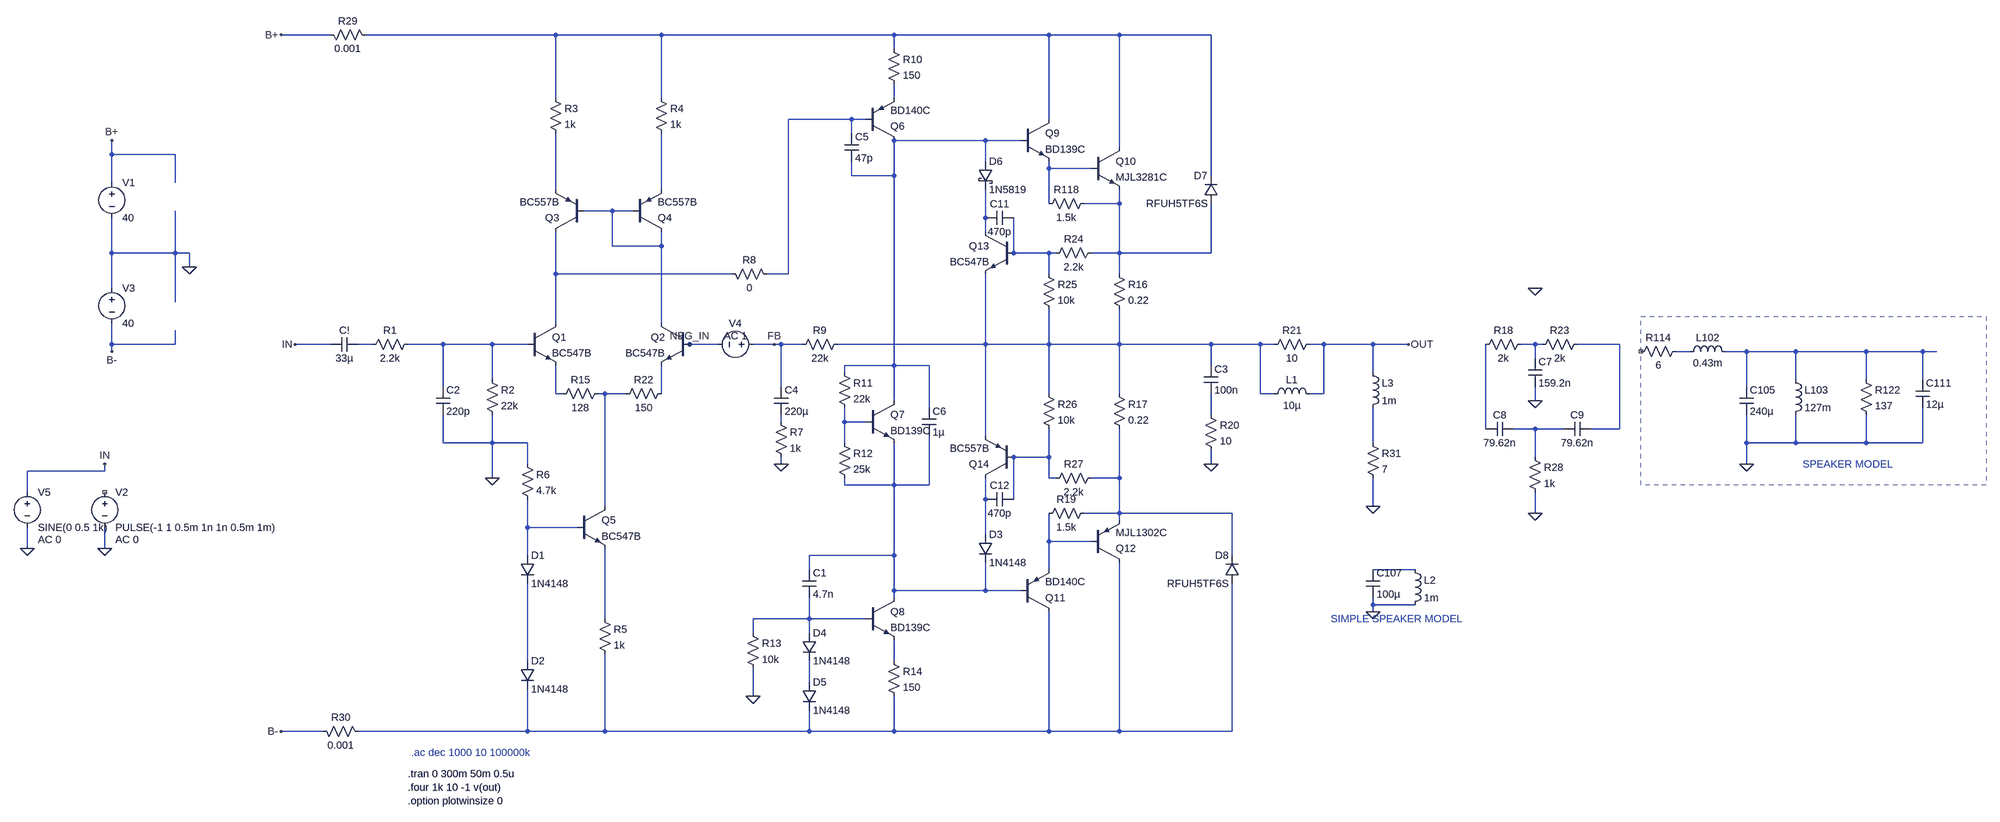
[diagram p0: schematic class_ab.asc]
class_ab.asc, the LTspice schematic file:
Version 4
SHEET 1 3476 872
WIRE -528 -880 -640 -880
WIRE -16 -880 -448 -880
WIRE 224 -880 -16 -880
WIRE 752 -880 224 -880
WIRE 1104 -880 752 -880
WIRE 1264 -880 1104 -880
WIRE 1472 -880 1264 -880
WIRE 752 -848 752 -880
WIRE -16 -736 -16 -880
WIRE 224 -736 224 -880
WIRE 752 -736 752 -768
WIRE 656 -688 512 -688
WIRE 688 -688 656 -688
WIRE 1104 -688 1104 -880
WIRE 656 -656 656 -688
WIRE 960 -640 752 -640
WIRE 1040 -640 960 -640
WIRE 1264 -624 1264 -880
WIRE -1024 -608 -1024 -640
WIRE -880 -608 -1024 -608
WIRE 960 -592 960 -640
WIRE 1104 -576 1104 -592
WIRE 1200 -576 1104 -576
WIRE 656 -560 656 -592
WIRE 752 -560 752 -640
WIRE 752 -560 656 -560
WIRE 1472 -560 1472 -880
WIRE -1024 -544 -1024 -608
WIRE -880 -544 -880 -608
WIRE -16 -528 -16 -656
WIRE 224 -528 224 -656
WIRE 1104 -496 1104 -576
WIRE 1264 -496 1264 -528
WIRE 1264 -496 1184 -496
WIRE 112 -480 48 -480
WIRE 160 -480 112 -480
WIRE 960 -464 960 -528
WIRE 960 -432 960 -464
WIRE 112 -400 112 -480
WIRE 224 -400 224 -432
WIRE 224 -400 112 -400
WIRE -1024 -384 -1024 -464
WIRE -880 -384 -880 -480
WIRE -880 -384 -1024 -384
WIRE -848 -384 -880 -384
WIRE 1024 -384 1024 -464
WIRE 1104 -384 1024 -384
WIRE 1120 -384 1104 -384
WIRE 1264 -384 1264 -496
WIRE 1264 -384 1200 -384
WIRE 1472 -384 1472 -496
WIRE 1472 -384 1264 -384
WIRE -848 -352 -848 -384
WIRE -16 -336 -16 -432
WIRE 384 -336 -16 -336
WIRE 512 -336 512 -688
WIRE 512 -336 464 -336
WIRE 1104 -336 1104 -384
WIRE 1264 -336 1264 -384
WIRE -1024 -304 -1024 -384
WIRE -880 -272 -880 -384
WIRE -16 -224 -16 -336
WIRE 224 -224 224 -400
WIRE -1024 -176 -1024 -224
WIRE -880 -176 -880 -208
WIRE -880 -176 -1024 -176
WIRE -528 -176 -608 -176
WIRE -432 -176 -464 -176
WIRE -272 -176 -352 -176
WIRE -160 -176 -272 -176
WIRE -80 -176 -160 -176
WIRE 288 -176 272 -176
WIRE 352 -176 288 -176
WIRE 480 -176 432 -176
WIRE 496 -176 480 -176
WIRE 544 -176 496 -176
WIRE 960 -176 960 -336
WIRE 960 -176 624 -176
WIRE 1104 -176 1104 -256
WIRE 1104 -176 960 -176
WIRE 1264 -176 1264 -256
WIRE 1264 -176 1104 -176
WIRE 1472 -176 1264 -176
WIRE 1584 -176 1472 -176
WIRE 1616 -176 1584 -176
WIRE 1728 -176 1696 -176
WIRE 1840 -176 1728 -176
WIRE 1920 -176 1840 -176
WIRE 2208 -176 2176 -176
WIRE 2224 -176 2208 -176
WIRE 2400 -176 2304 -176
WIRE -1024 -160 -1024 -176
WIRE 2560 -160 2528 -160
WIRE 2688 -160 2640 -160
WIRE 2800 -160 2688 -160
WIRE 2960 -160 2800 -160
WIRE 3088 -160 2960 -160
WIRE 3120 -160 3088 -160
WIRE 2208 -144 2208 -176
WIRE 752 -128 752 -560
WIRE 752 -128 640 -128
WIRE 832 -128 752 -128
WIRE 1472 -128 1472 -176
WIRE 640 -112 640 -128
WIRE 1840 -112 1840 -176
WIRE -160 -96 -160 -176
WIRE 2800 -96 2800 -160
WIRE 2960 -96 2960 -160
WIRE 3088 -96 3088 -160
WIRE -272 -80 -272 -176
WIRE 496 -80 496 -176
WIRE 2688 -80 2688 -160
WIRE -16 -64 -16 -128
WIRE 0 -64 -16 -64
WIRE 96 -64 80 -64
WIRE 144 -64 96 -64
WIRE 224 -64 224 -128
WIRE 1104 -64 1104 -176
WIRE 1264 -64 1264 -176
WIRE 1584 -64 1584 -176
WIRE 1616 -64 1584 -64
WIRE 1728 -64 1728 -176
WIRE 1728 -64 1696 -64
WIRE 752 -48 752 -128
WIRE 2208 -48 2208 -80
WIRE 832 -32 832 -128
WIRE 1472 -16 1472 -64
WIRE 496 0 496 -16
WIRE 640 0 640 -32
WIRE 688 0 640 0
WIRE 2096 16 2096 -176
WIRE 2208 16 2160 16
WIRE 2272 16 2208 16
WIRE 2400 16 2400 -176
WIRE 2400 16 2336 16
WIRE 960 32 960 -176
WIRE -272 48 -272 -16
WIRE -160 48 -160 -16
WIRE -160 48 -272 48
WIRE -80 48 -160 48
WIRE 640 48 640 0
WIRE 1840 48 1840 -32
WIRE 2688 48 2688 -16
WIRE 2800 48 2800 -16
WIRE 2800 48 2688 48
WIRE 2960 48 2960 -16
WIRE 2960 48 2800 48
WIRE 3088 48 3088 -32
WIRE 3088 48 2960 48
WIRE 1104 80 1104 16
WIRE 1104 80 1024 80
WIRE 2208 80 2208 16
WIRE -80 96 -80 48
WIRE 496 96 496 80
WIRE 1472 96 1472 64
WIRE 2688 96 2688 48
WIRE -1040 112 -1040 96
WIRE -1040 112 -1216 112
WIRE -160 128 -160 48
WIRE 1104 128 1104 80
WIRE 1120 128 1104 128
WIRE 1264 128 1264 16
WIRE 1264 128 1200 128
WIRE 640 144 640 128
WIRE 752 144 752 48
WIRE 752 144 640 144
WIRE 832 144 832 32
WIRE 832 144 752 144
WIRE -1216 160 -1216 112
WIRE 960 176 960 128
WIRE 1024 176 1024 80
WIRE 96 192 96 -64
WIRE 1840 192 1840 128
WIRE 1264 208 1264 128
WIRE 1264 208 1184 208
WIRE 1520 208 1264 208
WIRE 2208 208 2208 160
WIRE 1264 224 1264 208
WIRE -80 240 -80 176
WIRE 32 240 -80 240
WIRE 960 256 960 176
WIRE 1104 272 1104 208
WIRE 1200 272 1104 272
WIRE -1216 288 -1216 240
WIRE -1040 288 -1040 240
WIRE -80 304 -80 240
WIRE 752 304 752 144
WIRE 752 304 560 304
WIRE 1520 304 1520 208
WIRE 560 336 560 304
WIRE 1104 336 1104 272
WIRE 1936 336 1840 336
WIRE 752 384 752 304
WIRE 960 384 960 320
WIRE 960 384 752 384
WIRE 1040 384 960 384
WIRE 752 400 752 384
WIRE 1840 416 1840 400
WIRE 1936 416 1840 416
WIRE 1840 432 1840 416
WIRE 96 448 96 288
WIRE 560 448 560 400
WIRE 560 448 432 448
WIRE 688 448 560 448
WIRE 432 480 432 448
WIRE 560 480 560 448
WIRE -80 544 -80 368
WIRE 752 544 752 496
WIRE 560 592 560 544
WIRE 432 624 432 560
WIRE -544 704 -640 704
WIRE -80 704 -80 608
WIRE -80 704 -464 704
WIRE 96 704 96 528
WIRE 96 704 -80 704
WIRE 560 704 560 656
WIRE 560 704 96 704
WIRE 752 704 752 624
WIRE 752 704 560 704
WIRE 1104 704 1104 432
WIRE 1104 704 752 704
WIRE 1264 704 1264 320
WIRE 1264 704 1104 704
WIRE 1520 704 1520 368
WIRE 1520 704 1264 704
FLAG 496 96 0
FLAG -608 -176 IN
FLAG -1040 96 IN
FLAG -1040 288 0
FLAG -640 704 B-
FLAG -640 -880 B+
FLAG -848 -352 0
FLAG -1024 -640 B+
FLAG -1024 -160 B-
FLAG 1920 -176 OUT
FLAG -160 128 0
FLAG 2688 96 0
FLAG 432 624 0
FLAG 288 -176 NEG_IN
FLAG 480 -176 FB
FLAG 1472 96 0
FLAG 1840 432 0
FLAG -1216 288 0
FLAG 2208 -48 0
FLAG 2208 -304 0
FLAG 2208 208 0
FLAG 1840 192 0
SYMBOL npn 32 192 R0
SYMATTR InstName Q5
SYMATTR Value BC547B
SYMBOL res 80 432 R0
SYMATTR InstName R5
SYMATTR Value 1k
SYMBOL res -96 80 R0
SYMATTR InstName R6
SYMATTR Value 4.7k
SYMBOL npn -80 -224 R0
SYMATTR InstName Q1
SYMATTR Value BC547B
SYMBOL npn 288 -224 M0
SYMATTR InstName Q2
SYMATTR Value BC547B
SYMBOL voltage -1040 144 R0
WINDOW 123 24 124 Left 2
WINDOW 39 0 0 Left 0
SYMATTR Value2 AC 0
SYMATTR InstName V2
SYMATTR Value PULSE(-1 1 0.5m 1n 1n 0.5m 1m)
SYMBOL cap -464 -192 R90
WINDOW 0 0 32 VBottom 2
WINDOW 3 32 32 VTop 2
SYMATTR InstName C!
SYMATTR Value 33µ
SYMBOL voltage -1024 -320 R0
WINDOW 123 0 0 Left 0
WINDOW 39 24 44 Left 2
SYMATTR InstName V3
SYMATTR Value 40
SYMBOL res 640 -192 R90
WINDOW 0 0 56 VBottom 2
WINDOW 3 32 56 VTop 2
SYMATTR InstName R9
SYMATTR Value 22k
SYMBOL res 480 -16 R0
SYMATTR InstName R7
SYMATTR Value 1k
SYMBOL pnp 688 -640 M180
SYMATTR InstName Q6
SYMATTR Value BD140C
SYMBOL npn 1200 -624 R0
SYMATTR InstName Q10
SYMATTR Value MJL3281C
SYMBOL pnp 1200 320 M180
SYMATTR InstName Q12
SYMATTR Value MJL1302C
SYMBOL res 1248 -352 R0
SYMATTR InstName R16
SYMATTR Value 0.22
SYMBOL res 1248 -80 R0
SYMATTR InstName R17
SYMATTR Value 0.22
SYMBOL cap 480 -80 R0
SYMATTR InstName C4
SYMATTR Value 220µ
SYMBOL res 736 -864 R0
SYMATTR InstName R10
SYMATTR Value 150
SYMBOL npn 1040 -688 R0
SYMATTR InstName Q9
SYMATTR Value BD139C
SYMBOL pnp 1040 432 M180
SYMATTR InstName Q11
SYMATTR Value BD140C
SYMBOL res -176 -112 R0
SYMATTR InstName R2
SYMATTR Value 22k
SYMBOL cap -288 -80 R0
SYMATTR InstName C2
SYMATTR Value 220p
SYMBOL res -336 -192 R90
WINDOW 0 0 56 VBottom 2
WINDOW 3 32 56 VTop 2
SYMATTR InstName R1
SYMATTR Value 2.2k
SYMBOL diode -96 304 R0
SYMATTR InstName D1
SYMATTR Value 1N4148
SYMBOL diode -96 544 R0
SYMATTR InstName D2
SYMATTR Value 1N4148
SYMBOL pnp 48 -432 R180
SYMATTR InstName Q3
SYMATTR Value BC557B
SYMBOL pnp 160 -432 M180
SYMATTR InstName Q4
SYMATTR Value BC557B
SYMBOL npn 688 400 R0
SYMATTR InstName Q8
SYMATTR Value BD139C
SYMBOL res 736 528 R0
SYMATTR InstName R14
SYMATTR Value 150
SYMBOL diode 544 480 R0
SYMATTR InstName D4
SYMATTR Value 1N4148
SYMBOL diode 544 592 R0
SYMATTR InstName D5
SYMATTR Value 1N4148
SYMBOL res 416 464 R0
SYMATTR InstName R13
SYMATTR Value 10k
SYMBOL res -32 -752 R0
SYMATTR InstName R3
SYMATTR Value 1k
SYMBOL res 208 -752 R0
SYMATTR InstName R4
SYMATTR Value 1k
SYMBOL cap 640 -656 R0
SYMATTR InstName C5
SYMATTR Value 47p
SYMBOL res 368 -352 M90
WINDOW 0 0 56 VBottom 2
WINDOW 3 32 56 VTop 2
SYMATTR InstName R8
SYMATTR Value 0
SYMBOL npn 688 -48 R0
SYMATTR InstName Q7
SYMATTR Value BD139C
SYMBOL res 624 -128 R0
SYMATTR InstName R11
SYMATTR Value 22k
SYMBOL res 624 32 R0
SYMATTR InstName R12
SYMATTR Value 25k
SYMBOL res 1200 -512 R90
WINDOW 0 0 56 VBottom 2
WINDOW 3 32 56 VTop 2
SYMATTR InstName R118
SYMATTR Value 1.5k
SYMBOL res 1200 192 R90
WINDOW 0 0 56 VBottom 2
WINDOW 3 32 56 VTop 2
SYMATTR InstName R19
SYMATTR Value 1.5k
SYMBOL cap 1456 -128 R0
SYMATTR InstName C3
SYMATTR Value 100n
SYMBOL res 1456 -32 R0
SYMATTR InstName R20
SYMATTR Value 10
SYMBOL res 1712 -192 R90
WINDOW 0 0 56 VBottom 2
WINDOW 3 32 56 VTop 2
SYMATTR InstName R21
SYMATTR Value 10
SYMBOL ind 1600 -48 R270
WINDOW 0 32 56 VTop 2
WINDOW 3 5 56 VBottom 2
SYMATTR InstName L1
SYMATTR Value 10µ
SYMBOL res 1216 -400 R90
WINDOW 0 0 56 VBottom 2
WINDOW 3 32 56 VTop 2
SYMATTR InstName R24
SYMATTR Value 2.2k
SYMBOL npn 1024 -432 M0
SYMATTR InstName Q13
SYMATTR Value BC547B
SYMBOL res 1088 -352 R0
SYMATTR InstName R25
SYMATTR Value 10k
SYMBOL cap 1024 -480 R90
WINDOW 0 0 32 VBottom 2
WINDOW 3 32 32 VTop 2
SYMATTR InstName C11
SYMATTR Value 470p
SYMBOL pnp 1024 128 R180
SYMATTR InstName Q14
SYMATTR Value BC557B
SYMBOL res 1216 112 R90
WINDOW 0 0 56 VBottom 2
WINDOW 3 32 56 VTop 2
SYMATTR InstName R27
SYMATTR Value 2.2k
SYMBOL res 1088 -80 R0
SYMATTR InstName R26
SYMATTR Value 10k
SYMBOL cap 1024 160 R90
WINDOW 0 0 32 VBottom 2
WINDOW 3 32 32 VTop 2
SYMATTR InstName C12
SYMATTR Value 470p
SYMBOL voltage 448 -176 R90
WINDOW 0 -32 56 VBottom 2
WINDOW 3 32 56 VTop 2
WINDOW 123 -4 56 VBottom 2
WINDOW 39 0 0 Left 0
SYMATTR InstName V4
SYMATTR Value ""
SYMATTR Value2 AC 1
SYMBOL schottky 944 -592 R0
SYMATTR InstName D6
SYMATTR Value 1N5819
SYMATTR Description Diode
SYMATTR Type diode
SYMBOL diode 944 256 R0
SYMATTR InstName D3
SYMATTR Value 1N4148
SYMBOL voltage -1024 -560 R0
WINDOW 123 0 0 Left 0
WINDOW 39 24 44 Left 2
SYMATTR InstName V1
SYMATTR Value 40
SYMBOL ind 2544 -144 R270
WINDOW 0 32 56 VTop 2
WINDOW 3 5 56 VBottom 2
SYMATTR InstName L102
SYMATTR Value 0.43m
SYMBOL res 2544 -176 R90
WINDOW 0 0 56 VBottom 2
WINDOW 3 32 56 VTop 2
SYMATTR InstName R114
SYMATTR Value 6
SYMBOL cap 2672 -80 R0
SYMATTR InstName C105
SYMATTR Value 240µ
SYMBOL ind 2784 -112 R0
SYMATTR InstName L103
SYMATTR Value 127m
SYMBOL res 2944 -112 R0
SYMATTR InstName R122
SYMATTR Value 137
SYMBOL cap 3072 -96 R0
SYMATTR InstName C111
SYMATTR Value 12µ
SYMBOL cap 816 -32 R0
SYMATTR InstName C6
SYMATTR Value 1µ
SYMBOL voltage -1216 144 R0
WINDOW 123 24 124 Left 2
WINDOW 39 0 0 Left 0
SYMATTR Value2 AC 0
SYMATTR InstName V5
SYMATTR Value SINE(0 0.5 1k)
SYMBOL cap 1824 336 R0
SYMATTR InstName C107
SYMATTR Value 100µ
SYMBOL diode 1488 -496 R180
WINDOW 0 24 64 Left 2
WINDOW 3 24 0 Left 2
SYMATTR InstName D7
SYMATTR Value RFUH5TF6S
SYMBOL diode 1536 368 R180
WINDOW 0 24 64 Left 2
WINDOW 3 24 0 Left 2
SYMATTR InstName D8
SYMATTR Value RFUH5TF6S
SYMBOL ind 1920 320 R0
SYMATTR InstName L2
SYMATTR Value 1m
SYMBOL res 96 -80 R90
WINDOW 0 0 56 VBottom 2
WINDOW 3 32 56 VTop 2
SYMATTR InstName R15
SYMATTR Value 128
SYMBOL res 240 -80 R90
WINDOW 0 0 56 VBottom 2
WINDOW 3 32 56 VTop 2
SYMATTR InstName R22
SYMATTR Value 150
SYMBOL cap 544 336 R0
SYMATTR InstName C1
SYMATTR Value 4.7n
SYMBOL res 2192 -192 R90
WINDOW 0 0 56 VBottom 2
WINDOW 3 32 56 VTop 2
SYMATTR InstName R18
SYMATTR Value 2k
SYMBOL res 2320 -192 R90
WINDOW 0 0 56 VBottom 2
WINDOW 3 32 56 VTop 2
SYMATTR InstName R23
SYMATTR Value 2k
SYMBOL cap 2192 -144 R0
SYMATTR InstName C7
SYMATTR Value 159.2n
SYMBOL cap 2096 32 R270
WINDOW 0 32 32 VTop 2
WINDOW 3 0 32 VBottom 2
SYMATTR InstName C8
SYMATTR Value 79.62n
SYMBOL cap 2272 32 R270
WINDOW 0 32 32 VTop 2
WINDOW 3 0 32 VBottom 2
SYMATTR InstName C9
SYMATTR Value 79.62n
SYMBOL res 2192 64 R0
SYMATTR InstName R28
SYMATTR Value 1k
SYMBOL res -544 -896 M90
WINDOW 0 0 56 VBottom 2
WINDOW 3 32 56 VTop 2
SYMATTR InstName R29
SYMATTR Value 0.001
SYMBOL res -560 688 M90
WINDOW 0 0 56 VBottom 2
WINDOW 3 32 56 VTop 2
SYMATTR InstName R30
SYMATTR Value 0.001
SYMBOL ind 1824 -128 R0
SYMATTR InstName L3
SYMATTR Value 1m
SYMBOL res 1824 32 R0
SYMATTR InstName R31
SYMATTR Value 7
TEXT -352 800 Left 2 !.tran 0 300m 50m 0.5u\n.four 1k 10 -1 v(out)\n.option plotwinsize 0
TEXT -344 752 Left 2 ;.ac dec 1000 10 100000k
TEXT 2816 96 Left 2 ;SPEAKER MODEL
TEXT 1744 448 Left 2 ;SIMPLE SPEAKER MODEL
RECTANGLE Normal 3232 144 2448 -240 2

The netlist it stands for:
* class_ab.asc
Q5 N021 N033 N036 0 BC547B
R5 N036 N041 1k
R6 0 N033 4.7k
Q1 N012 N014 N020 0 BC547B
Q2 N009 NEG_IN N022 0 BC547B
V2 NC_01 0 PULSE(-1 1 0.5m 1n 1n 0.5m 1m) AC 0
C! N013 IN 33µ
V3 0 B- 40
R9 N015 FB 22k
R7 N024 0 1k
Q6 N004 N003 N002 0 BD140C
Q10 N001 N005 N008 0 MJL3281C
Q12 N041 N034 N030 0 MJL1302C
R16 N008 N015 0.22
R17 N015 N030 0.22
C4 FB N024 220µ
R10 N001 N002 150
Q9 N001 N004 N005 0 BD139C
Q11 N041 N031 N034 0 BD140C
R2 N014 0 22k
C2 N014 0 220p
R1 N014 N013 2.2k
D1 N033 N038 1N4148
D2 N038 N041 1N4148
Q3 N012 N009 N006 0 BC557B
Q4 N009 N009 N007 0 BC557B
Q8 N031 N037 N039 0 BD139C
R14 N039 N041 150
D4 N037 N040 1N4148
D5 N040 N041 1N4148
R13 N037 0 10k
R3 N001 N006 1k
R4 N001 N007 1k
C5 N003 N004 47p
R8 N012 N003 0
Q7 N004 N025 N031 0 BD139C
R11 N004 N025 22k
R12 N025 N031 25k
R118 N008 N005 1.5k
R19 N030 N034 1.5k
C3 N015 N023 100n
R20 N023 0 10
R21 OUT N015 10
L1 N015 OUT 10µ
R24 N008 N011 2.2k
Q13 N010 N011 N015 0 BC547B
R25 N011 N015 10k
C11 N011 N010 470p
Q14 N032 N029 N015 0 BC557B
R27 N030 N029 2.2k
R26 N015 N029 10k
C12 N029 N032 470p
V4 FB NEG_IN AC 1
D6 N004 N010 1N5819
D3 N032 N031 1N4148
V1 B+ 0 40
L102 N018 N019 0.43m
R114 N018 NC_02 6
C105 N019 0 240µ
L103 N019 0 127m
R122 N019 0 137
C111 N019 0 12µ
C6 N004 N031 1µ
V5 IN 0 SINE(0 0.5 1k) AC 0
C107 N035 0 100µ
D7 N008 N001 RFUH5TF6S
D8 N041 N030 RFUH5TF6S
L2 N035 0 1m
R15 N021 N020 128
R22 N022 N021 150
C1 N031 N037 4.7n
R18 N016 N026 2k
R23 N017 N016 2k
C7 N016 0 159.2n
C8 N026 N027 79.62n
C9 N027 N017 79.62n
R28 N027 0 1k
R29 B+ N001 0.001
R30 B- N041 0.001
L3 OUT N028 1m
R31 N028 0 7
.model D D
.lib standard.dio
.model NPN NPN
.model PNP PNP
.lib standard.bjt
.tran 0 300m 50m 0.5u
.four 1k 10 -1 v(out)
.option plotwinsize 0
* .ac dec 1000 10 100000k
* SPEAKER MODEL
* SIMPLE SPEAKER MODEL
.backanno
.end